# EasyEDA Pro project IMU-V1.eprj

# Schematic Schematic1
Create Date: 2023-02-26; Page Name: P1; Project Name: IMU; Schematic Name: Schematic1; Update Date: 2023-02-27; Company: 嘉立创EDA; Page Size: A4; Version: V1.0
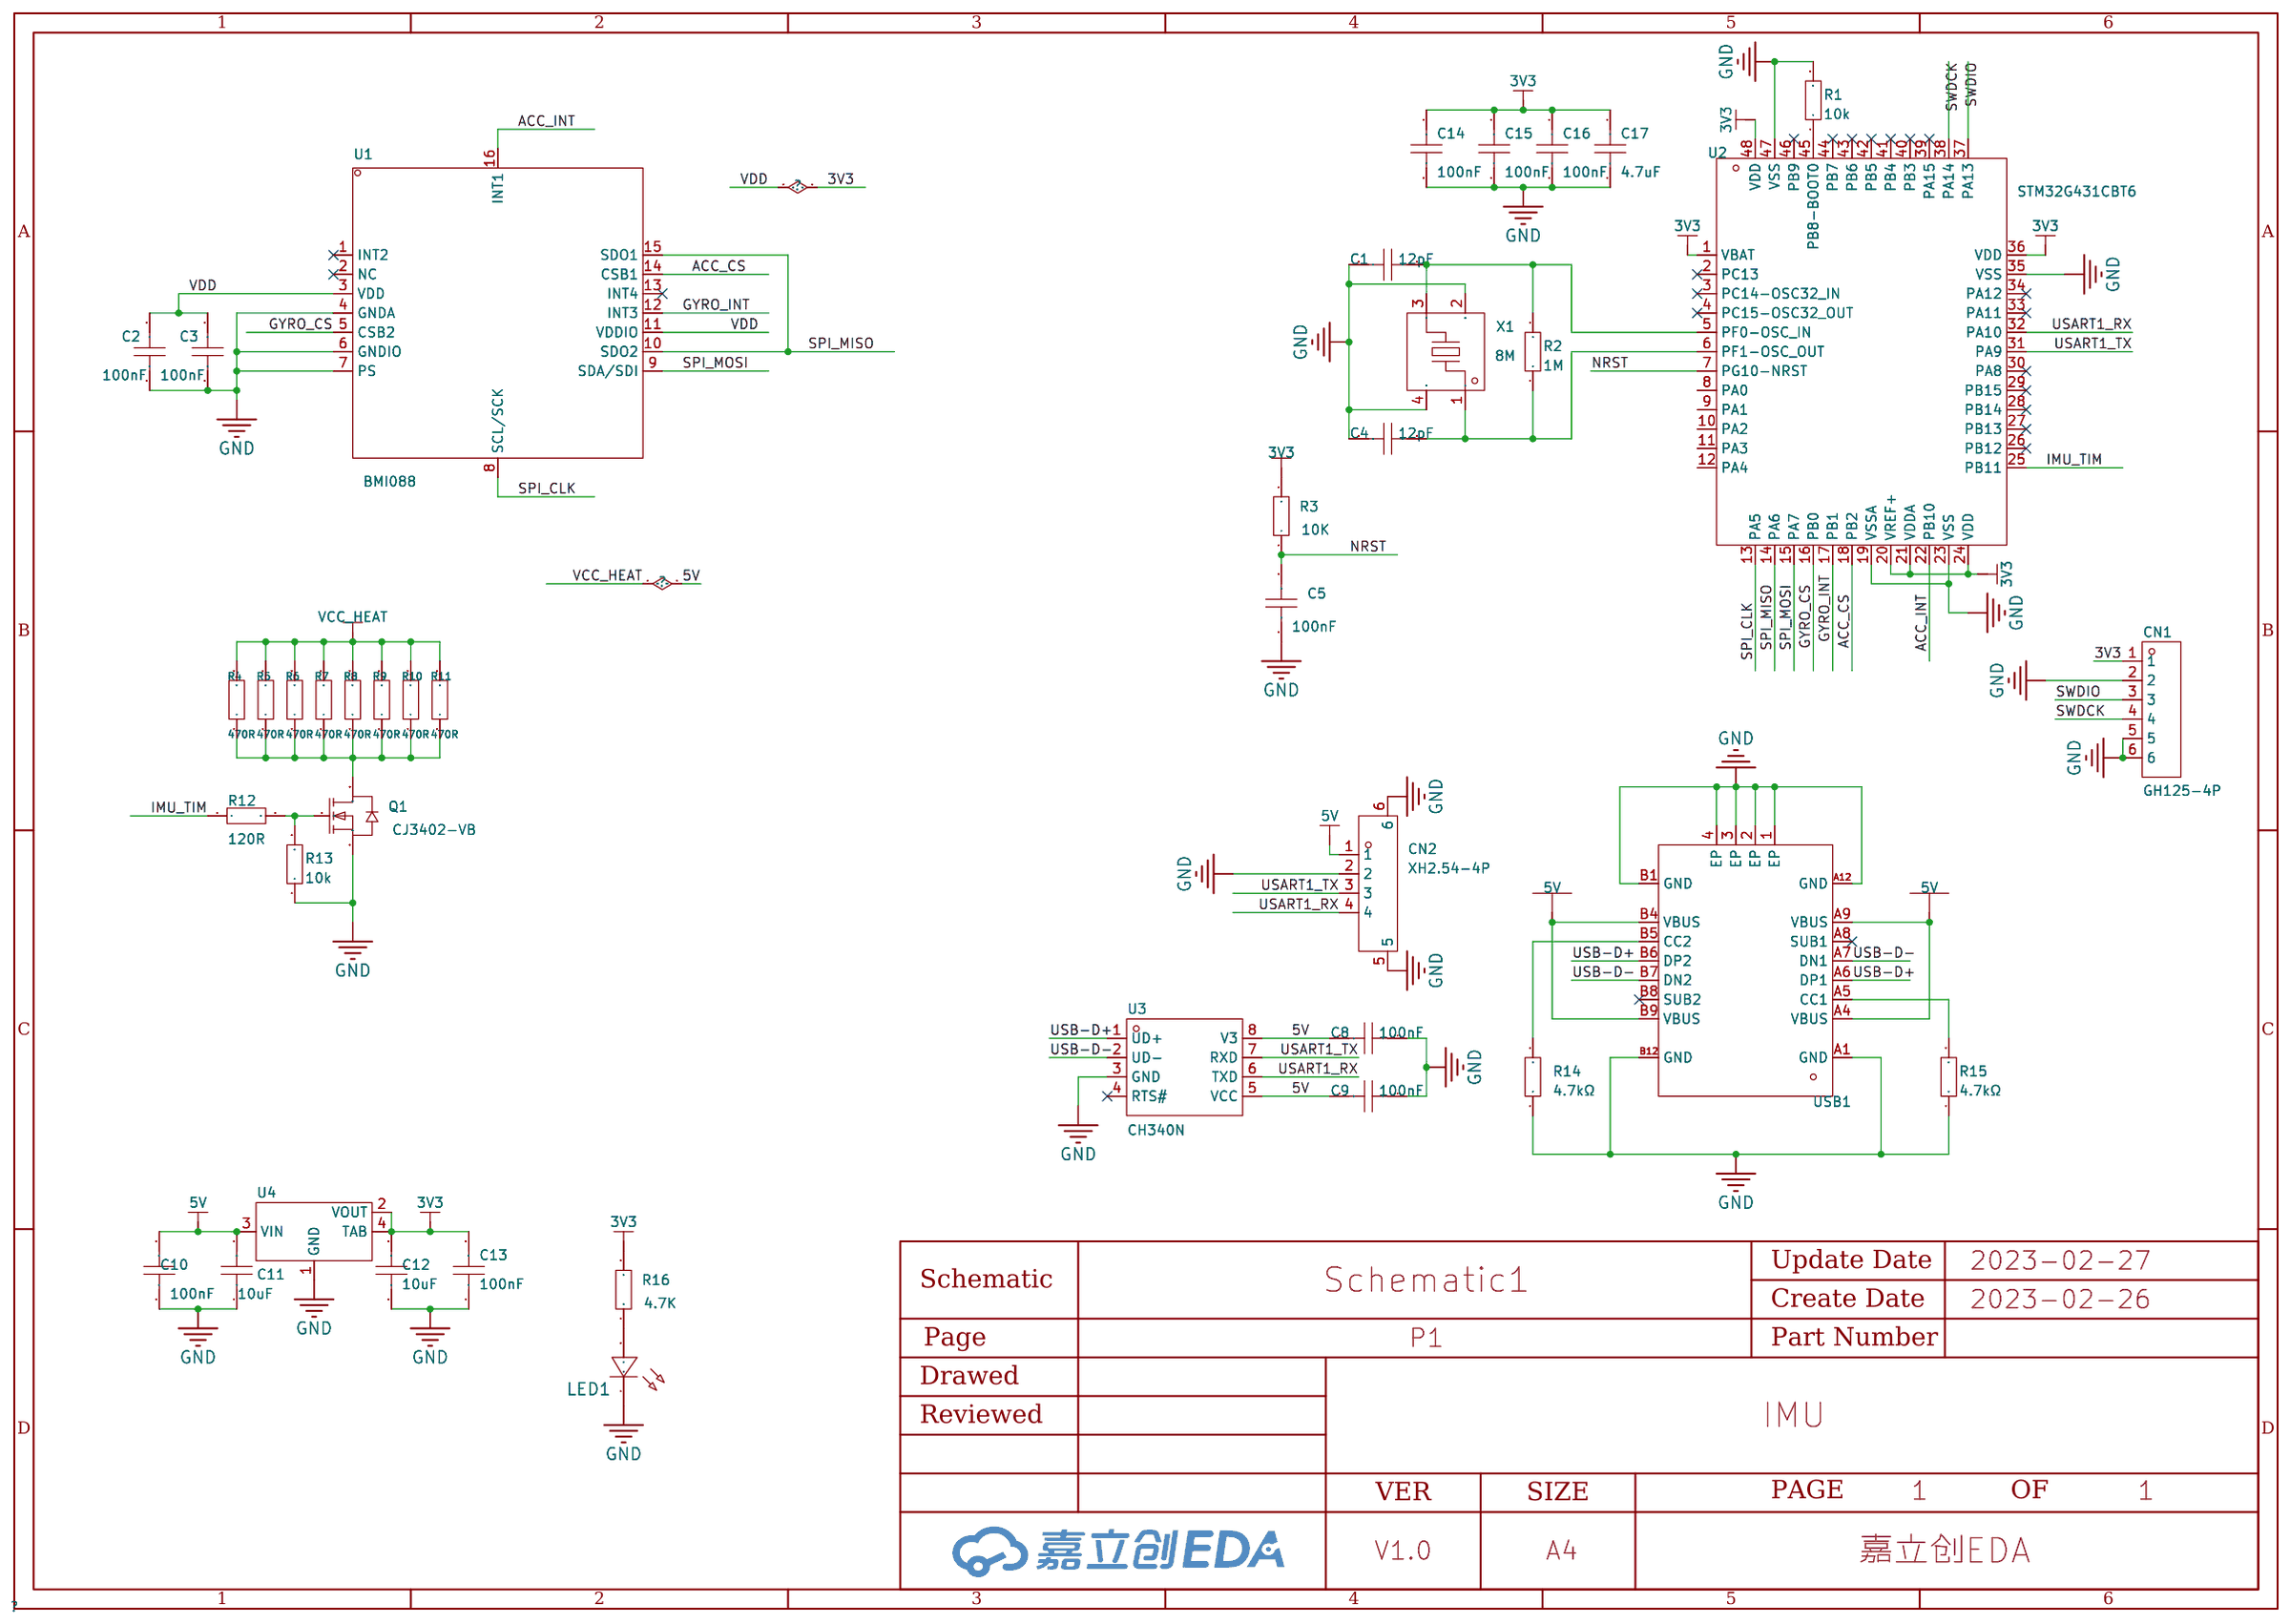
[diagram p0: schematic sheet]

## Parts
C1  12pF  [C0603]
C2  100nF  [C0603]
C3  100nF  [C0603]
C4  12pF  [C0603]
C5  100nF  [C0603_1]
C8  100nF  [C0603_1]
C9  100nF  [C0603_1]
C10  100nF  [C0603_1]
C11  10uF  [C0603_1]
C12  10uF  [C0603_1]
C13  100nF  [C0603_1]
C14  100nF  [C0603]
C15  100nF  [C0603]
C16  100nF  [C0603]
C17  4.7uF  [C0603]
CN1  GH125-4P  [CONN-SMD_4P-P1.27_GH125-S04DCA-00]
CN2  XH2.54-4P  [CONN-TH_4P-P0.20_XUNPU_WAFER-XH2.54-4PWB]
LED1  -  [LED_0603]
Q1  CJ3402-VB  [SOT-23-3_L2.9-W1.6-P1.90-LS2.8-BR]
R1  10k  [R0402]
R2  1M  [R0402]
R3  10K  [R0603_2]
R4  470R  [R0603]
R5  470R  [R0603]
R6  470R  [R0603]
R7  470R  [R0603]
R8  470R  [R0603]
R9  470R  [R0603]
R10  470R  [R0603]
R11  470R  [R0603]
R12  120R  [R0603]
R13  10k  [R0603]
R14  4.7kΩ  [R0402]
R15  4.7kΩ  [R0402]
R16  4.7K  [R0603]
U1  BMI088  [LGA-16_L4.5-W3.0-P0.50-BL]
U2  STM32G431CBT6  [LQFP-48_L7.0-W7.0-P0.50-LS9.0-BL]
U3  CH340N  [SOP-8_L4.9-W3.9-P1.27-LS6.0-BL]
U4  -  [SOT_224]
USB1  -  [USB-C-SMD_KH-TYPE-C-16P_1]
X1  8M  [CRYSTAL-SMD_4P-L3.2-W2.5-BL_1]

## Library data of the parts
C1-C4 C14-C17 = CAP_0603: Supplier Footprint: 0603; Check: true
C5 C8-C13 = CAP_604: Supplier Footprint: 0603; Check: true
CN1 = GH125-S04DCA-00: 参考系列:-;间距:1.25mm;插针结构:1x4P;排数:1;每排PIN数:4;行距:-;公母:公型插针;安装方式:卧贴;额定电流:1A;工作温度范围:-25℃~+85℃;; LCSC Part Name: 1.25mm 1x4P 卧贴; Supplier Part: C2886767; Manufacturer: JS(钜硕电子); Supplier Footprint: SMD,P=1.25mm; JLCPCB Part Class: Extended Part; Datasheet: https://atta.szlcsc.com/upload/public/pdf/source/20210818/CD11791E5ED3EDF45A7009E9C8A2BD4C.pdf; Supplier: LCSC; Pitch: 1.25mm; Pins Structure: 1x4P; Number of Rows: 1; Number of PINs Per Row: 4; Gender: 公型插针; Mounting Style: 卧贴; Current Rating (Max): 1A; Operating Temperature Range: -25℃~+85℃; Check: true
CN2 = WAFER-XH2.54-4PWB: LCSC Part Name: XH2.54mm 4P 卧贴; Supplier Part: C3029478; Manufacturer: XUNPU(讯普); Supplier Footprint: SMD,P=2.5mm; JLCPCB Part Class: Extended Part; Datasheet: https://atta.szlcsc.com/upload/public/pdf/source/20220527/7ACD2214A426F03D9ACD52F5A71E518C.pdf; Supplier: LCSC; Check: true
LED1 = LED_0603-R: Supplier Footprint: 0603; Check: true
Q1 = CJ3402-VB: 类型:N沟道;漏源电压(Vdss):30V;连续漏极电流(Id):6.5A;功率(Pd):-;导通电阻(RDS(on)@Vgs,Id):30mΩ@10V,6.5A;阈值电压(Vgs(th)@Id):-;栅极电荷(Qg@Vgs):-;输入电容(Ciss@Vds):-;反向传输电容(Crss@Vds):-;; LCSC Part Name: N沟道 30V 6.5A; Supplier Part: C709940; Manufacturer: VBsemi(微碧); Supplier Footprint: SOT-23; JLCPCB Part Class: Extended Part; Datasheet: https://atta.szlcsc.com/upload/public/pdf/source/20200723/C709940_FC7E0D7FD36813A0D48B4CA5756C6C42.pdf; Supplier: LCSC; Type: N沟道; Drain Source Voltage (Vdss): 30V; Continuous Drain Current (Id): 6.5A; Drain Source On Resistance (RDS(on)@Vgs,Id): 30mΩ@10V,6.5A; Check: true
R1 R2 R14 R15 = RMC04025.1K5%N: 阻值:5.1kΩ;精度:±5%;功率:1/16W;; LCSC Part Name: 5.1kΩ ±5% 1/16W; Supplier Part: C325524; Manufacturer: Tyohm(幸亚电阻); Supplier Footprint: 0402; JLCPCB Part Class: Extended Part; Datasheet: https://atta.szlcsc.com/upload/public/pdf/source/20190115/C325524_522AE7765A4DE6F7DC0B90EDB62F83C2.pdf; Supplier: LCSC; Tolerance: ±5%; Power(Watts): 1/16W; Check: true
R3 = Res_605: Supplier Footprint: 0603; Check: true
R4-R13 R16 = Res_0603: Supplier Footprint: 0603; Check: true
U1 = BMI088: Supplier Part: C194919; Manufacturer: Bosch(博世); Supplier Footprint: LGA-16; JLCPCB Part Class: Extended Part; Datasheet: https://atta.szlcsc.com/upload/public/pdf/source/20180628/C194919_66CCF125FF968C218A4D358C68AC68D6.pdf; Supplier: LCSC; Check: true
U2 = STM32G431CBT6: CPU内核:ARM Cortex-M4;CPU最大主频:170MHz;工作电压范围:1.71V~3.6V;程序存储容量:128KB;RAM总容量:32KB;EEPROM/数据 FLASH容量:128KB;GPIO端口数量:38;ADC(位数):12bit;DAC(位数):12bit;(E)PWM(位数):-;外设/功能:DMA；PWM；看门狗;内部振荡器:有;工作温度范围:-40℃~+85℃;; LCSC Part Name: ARM Cortex-M4 170MHz; Supplier Part: C529355; Manufacturer: ST(意法半导体); Supplier Footprint: LQFP-48(7x7); JLCPCB Part Class: Extended Part; Datasheet: https://atta.szlcsc.com/upload/public/pdf/source/20200511/C529354_7C66CF00837B904D0C15DCE45B69418C.pdf; Supplier: LCSC; CPU Core: ARM Cortex-M4; CPU Maximum Speed: 170MHz; Operating Voltage Range: 1.71V~3.6V; Program Storage Size: 128KB; Program Memory Type: FLASH; RAM Size: 32KB; EEPROM: 128KB; GPIO Ports Number: 38; ADC (Bit): 12bit; DAC (Bit): 12bit; Peripheral/Function: DMA；PWM；看门狗; Internal Oscillator: 有; Operating Temperature Range: -40℃~+85℃; Check: true
U3 = CH340N: Supplier Part: C2977777; Manufacturer: WCH(南京沁恒); Supplier Footprint: SOP-8; JLCPCB Part Class: Extended Part; Datasheet: https://atta.szlcsc.com/upload/public/pdf/source/20220223/82A45E4FF89B3EDCAD50B354450A7EF4.pdf; Supplier: LCSC; Check: true
U4 = AMS1117_1: Supplier Footprint: SOT_223; Check: true
USB1 = kh-type-c-16p_2: Type-C母座 16PIN 立式四角贴板无压片; LCSC Part Name: Type-C母座; Supplier Part: C709357; Manufacturer: kinghelm(金航标); Manufacturer Part: KH-TYPE-C-16P; LCSC Stock: 5637; LCSC On Sale: 1; Price: 0.484; JLCPCB Part Class: Extended Part; JLCPCB Stock: 2220; JLCPCB On Sale: 1; Datasheet: https://atta.szlcsc.com/upload/public/pdf/source/20200911/C709357_AA8DCEB38BB20E3035A7ED7AE7667837.pdf; Supplier: LCSC; Check: true
X1 = 3225-12-16-10-10/A_1: 工作温度-40℃~+95℃; LCSC Part Name: 3225-12-16-10-10/A; Supplier Part: C2981641; Manufacturer: LIMING(利明); Supplier Footprint: SMD3225-4P; JLCPCB Part Class: Extended Part; Datasheet: https://atta.szlcsc.com/upload/public/pdf/source/20220322/0ABBC579650689231413FB26C3617F3F.pdf; Supplier: LCSC; Check: true

## Nets
3V3: C2.2 C3.2 C12.2 C13.2 C14.1 C15.1 C16.1 C17.1 CN1.1 R3.2 R16.2 U1.3(VDD) U1.11(VDDIO) U2.1(VBAT) U2.20(VREF+) U2.21(VDDA) U2.24(VDD) U2.36(VDD) U2.48(VDD) U4.2(VOUT) U4.4(TAB)
5V: C8.2 C9.2 C10.2 C11.2 CN2.1 R4.2 R5.2 R6.2 R7.2 R8.2 R9.2 R10.2 R11.2 U3.5(VCC) U3.8(V3) U4.3(VIN) USB1.A4(VBUS) USB1.A9(VBUS) USB1.B4(VBUS) USB1.B9(VBUS)
GND: C1.2 C2.1 C3.1 C4.2 C5.1 C8.1 C9.1 C10.1 C11.1 C12.1 C13.1 C14.2 C15.2 C16.2 C17.2 CN1.2 CN1.5 CN1.6 CN2.2 CN2.5 CN2.6 LED1.1(C) Q1.2(S) R1.2 R13.1 R14.1 R15.1 U1.4(GNDA) U1.6(GNDIO) U1.7(PS) U2.19(VSSA) U2.23(VSS) U2.35(VSS) U2.47(VSS) U3.3(GND) U4.1(GND) USB1.1(EP) USB1.2(EP) USB1.3(EP) USB1.4(EP) USB1.A1(GND) USB1.A12(GND) USB1.B1(GND) USB1.B12(GND) X1.2(GND) X1.4(GND)
ACC_CS: U1.14(CSB1) U2.18(PB2)
ACC_INT: U1.16(INT1) U2.22(PB10)
GYRO_CS: U1.5(CSB2) U2.16(PB0)
GYRO_INT: U1.12(INT3) U2.17(PB1)
IMU_TIM: R12.1 U2.25(PB11)
NRST: C5.2 R3.1 U2.7(PG10-NRST)
SPI_CLK: U1.8(SCL/SCK) U2.13(PA5)
SPI_MISO: U1.10(SDO2) U1.15(SDO1) U2.14(PA6)
SPI_MOSI: U1.9(SDA/SDI) U2.15(PA7)
SWDCK: CN1.4 U2.38(PA14)
SWDIO: CN1.3 U2.37(PA13)
USART1_RX: CN2.4 U2.32(PA10) U3.6(TXD)
USART1_TX: CN2.3 U2.31(PA9) U3.7(RXD)
USB-D+: U3.1(UD+) USB1.A6(DP1) USB1.B6(DP2)
USB-D-: U3.2(UD-) USB1.A7(DN1) USB1.B7(DN2)
$C1_1: C1.1 R2.2 U2.5(PF0-OSC_IN) X1.3
$C4_1: C4.1 R2.1 U2.6(PF1-OSC_OUT) X1.1
$LED1_2: LED1.2(A) R16.1
$Q1_1: Q1.1(G) R12.2 R13.2
$Q1_3: Q1.3(D) R4.1 R5.1 R6.1 R7.1 R8.1 R9.1 R10.1 R11.1
$R1_1: R1.1 U2.45(PB8-BOOT0)
$R14_2: R14.2 USB1.B5(CC2)
$R15_2: R15.2 USB1.A5(CC1)

Not connected (* = marked no-connect by the designer): U1 1(INT2)* 2(NC)* 13(INT4)*; U2 2(PC13)* 3(PC14-OSC32_IN)* 4(PC15-OSC32_OUT)* 8(PA0) 9(PA1) 10(PA2) 11(PA3) 12(PA4) 26(PB12)* 27(PB13)* 28(PB14)* 29(PB15)* 30(PA8)* 33(PA11)* 34(PA12)* 39(PA15)* 40(PB3)* 41(PB4)* 42(PB5)* 43(PB6)* 44(PB7)* 46(PB9)*; U3 4(RTS#)*; USB1 A8(SUB1)* B8(SUB2)*

# Board PCB1
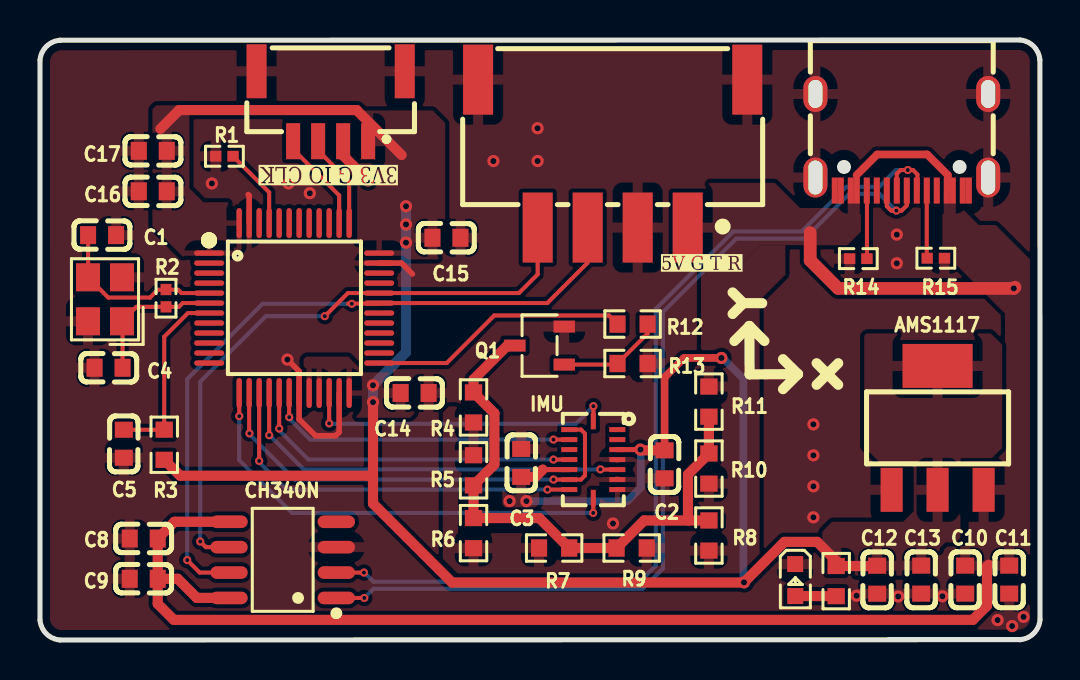
[diagram p1: board, top side]
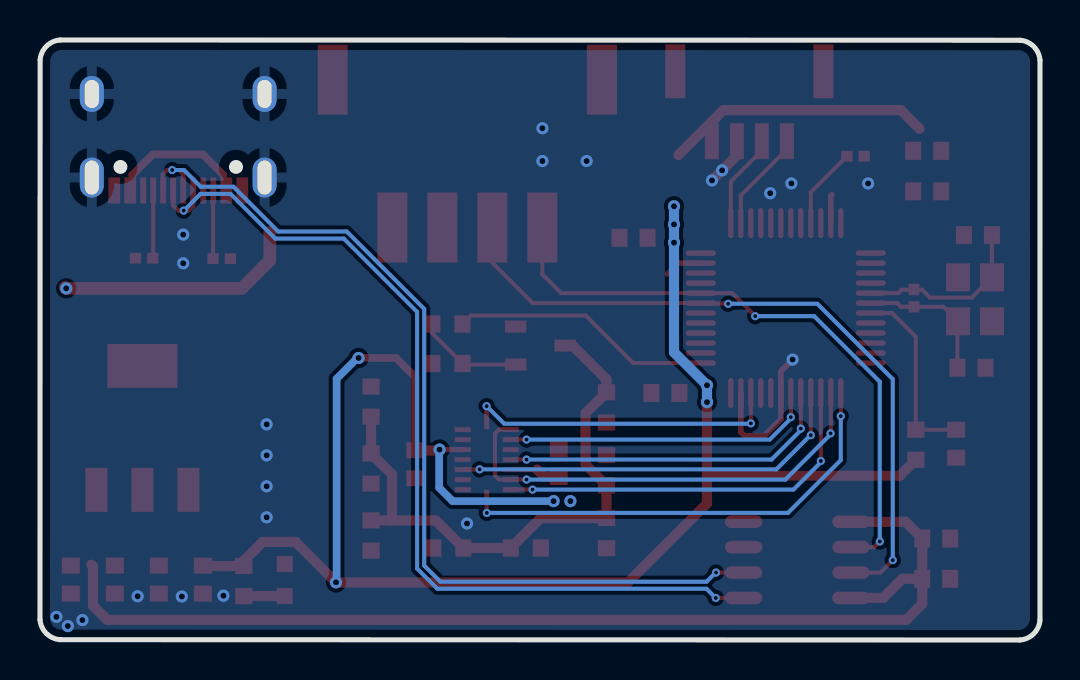
[diagram p2: board, bottom side, seen from below]

Outline 50 x 30.01 mm; copper layers: Top Layer, Bottom Layer. Coordinates in mm from the lower left corner of the outline.
Outline path: 0,29 arc(0.31,29.68) 1,30 49,30.01 arc(49.68,29.7) 50,29.01 50,1.02 arc(49.69,0.33) 49,0.02 1,0 arc(0.32,0.31) 0,1 0,29
Stack: Top Layer 0.035mm / Dielectric1 1.51mm FR4 er 4.5 / Bottom Layer 0.035mm

## Design rules (mm)
net 3V3: PWR
net GND: PWR
net 5V: PWR
net USB-D+: DP1
net USB-D-: DP1
spacing safeClearance (default): track to track 0.152, other pairs 0.152 to 0.381
track width trackWidth (default): min 0.127, default 0.203, max 2.54
differential pair differentialPair (default): width min 0.127, default 0.254, max 2.54; gap min 0.152, default 0.152
via viaSize (default): diameter min 0.406, default 0.61, max 10; hole min 0.203, default 0.305, max 5.999

## Placement (name value [footprint] x y rotation side)
3V3GNDSIOSCLK  GH125-4P  [CONN-SMD_4P-P1.27_GH125-S04DCA-00]  14.53 26.7 180 top
5V G T R  XH2.54-4P  [CONN-TH_4P-P0.20_XUNPU_WAFER-XH2.54-4PWB]  28.63 24.33 180 top
AMS1117  -  [SOT_224]  44.88 10.64 0 top
C1  12pF  [C0603]  3.1 20.25 0 top
C2  100nF  [C0603]  31.23 8.79 90 top
C3  100nF  [C0603]  24.06 8.86 270 top
C4  12pF  [C0603]  3.43 13.62 180 top
C5  100nF  [C0603_1]  4.19 9.82 90 top
C8  100nF  [C0603_1]  5.19 5.08 0 top
C9  100nF  [C0603_1]  5.19 3.06 0 top
C10  100nF  [C0603_1]  46.26 3.02 90 top
C11  10uF  [C0603_1]  48.46 3.02 90 top
C12  10uF  [C0603_1]  41.86 3.02 90 top
C13  100nF  [C0603_1]  44.06 3.02 90 top
C14  100nF  [C0603]  18.73 12.36 0 top
C15  100nF  [C0603]  20.32 20.12 0 top
C16  100nF  [C0603]  5.64 22.44 180 top
C17  4.7uF  [C0603]  5.64 24.47 180 top
CH340N  CH340N  [SOP-8_L4.9-W3.9-P1.27-LS6.0-BL]  12.13 4.01 90 top
IMU  BMI088  [LGA-16_L4.5-W3.0-P0.50-BL]  27.67 9.03 180 top
LED1  -  [LED_0603]  37.77 2.95 270 top
Q1  CJ3402-VB  [SOT-23-3_L2.9-W1.6-P1.90-LS2.8-BR]  24.98 14.73 0 top
R1  10k  [R0402]  9.22 24.2 180 top
R2  1M  [R0402]  6.3 17.1 90 top
R3  10K  [R0603_2]  6.21 9.77 270 top
R4  470R  [R0603]  21.68 11.63 270 top
R5  470R  [R0603]  21.68 8.49 90 top
R6  470R  [R0603]  21.68 5.35 270 top
R7  470R  [R0603]  25.71 4.6 180 top
R8  470R  [R0603]  33.45 5.23 270 top
R9  470R  [R0603]  29.58 4.6 0 top
R10  470R  [R0603]  33.45 8.58 270 top
R11  470R  [R0603]  33.45 11.92 90 top
R12  120R  [R0603]  29.63 15.8 0 top
R13  10k  [R0603]  29.63 13.83 180 top
R14  4.7kΩ  [R0402]  40.92 19.08 0 top
R15  4.7kΩ  [R0402]  44.79 19.1 180 top
R16  4.7K  [R0603]  39.81 2.95 90 top
U2  STM32G431CBT6  [LQFP-48_L7.0-W7.0-P0.50-LS9.0-BL]  12.71 16.6 270 top
USB1  -  [USB-C-SMD_KH-TYPE-C-16P_1]  43.09 24.9 180 top
X1  8M  [CRYSTAL-SMD_4P-L3.2-W2.5-BL_1]  3.25 17.04 90 top

## Footprints (pads in the part's own frame, mm; a bottom-side part is the same pattern mirrored in y, then rotated)
C0603
  rect 0.8x0.9 smd: 1(-0.7,0) 2(0.7,0)
C0603_1
  rect 0.8x0.9 smd: 1(-0.7,0) 2(0.7,0)
CONN-SMD_4P-P1.27_GH125-S04DCA-00
  rect 0.7x1.8 smd: 1(-1.875,1.75) 2(-0.625,1.75) 3(0.625,1.75) 4(1.875,1.75)
  rect 1x2.7 smd: 5(3.705,-1.75) 6(-3.705,-1.75)
CONN-TH_4P-P0.20_XUNPU_WAFER-XH2.54-4PWB
  rect 1.5x3.5 smd: 1(-3.75,3.7) 2(-1.25,3.7) 3(1.25,3.7) 4(3.75,3.7) 5(-6.73,-3.7) 6(6.73,-3.7)
CRYSTAL-SMD_4P-L3.2-W2.5-BL_1
  rect 1.4x1.2 smd: 1(-1.1,-0.85) 2(1.1,-0.85) 3(1.1,0.85) 4(-1.1,0.85)
LED_0603
  rect 0.8x0.8 smd: 1(-0.851,-0.01) 2(0.75,-0.005)
LGA-16_L4.5-W3.0-P0.50-BL
  rect 0.8x0.25 smd: 1(-1.2,-1.498) 2(-1.2,-0.998) 3(-1.2,-0.498) 4(-1.2,0.002) 5(-1.2,0.502) 6(-1.2,1.002) 7(-1.2,1.502) 9(1.2,1.502) 10(1.2,1.002) 11(1.2,0.502) 12(1.2,0.002) 13(1.2,-0.498) 14(1.2,-0.998) 15(1.2,-1.498)
  rect 0.25x0.8 smd: 8(0,1.915) 16(0,-1.915)
LQFP-48_L7.0-W7.0-P0.50-LS9.0-BL
  oval 0.27x1.5 smd: 1(-2.75,-4.25) 2(-2.25,-4.25) 3(-1.75,-4.25) 4(-1.25,-4.25) 5(-0.75,-4.25) 6(-0.25,-4.25) 7(0.25,-4.25) 8(0.75,-4.25) 9(1.25,-4.25) 10(1.75,-4.25) 11(2.25,-4.25) 12(2.75,-4.25) 25(2.75,4.25) 26(2.25,4.25) 27(1.75,4.25) 28(1.25,4.25) 29(0.75,4.25) 30(0.25,4.25) 31(-0.25,4.25) 32(-0.75,4.25) 33(-1.25,4.25) 34(-1.75,4.25) 35(-2.25,4.25) 36(-2.75,4.25)
  oval 1.5x0.27 smd: 13(4.25,-2.75) 14(4.25,-2.25) 15(4.25,-1.75) 16(4.25,-1.25) 17(4.25,-0.75) 18(4.25,-0.25) 19(4.25,0.25) 20(4.25,0.75) 21(4.25,1.25) 22(4.25,1.75) 23(4.25,2.25) 24(4.25,2.75) 37(-4.25,2.75) 38(-4.25,2.25) 39(-4.25,1.75) 40(-4.25,1.25) 41(-4.25,0.75) 42(-4.25,0.25) 43(-4.25,-0.25) 44(-4.25,-0.75) 45(-4.25,-1.25) 46(-4.25,-1.75) 47(-4.25,-2.25) 48(-4.25,-2.75)
R0402
  rect 0.566x0.54 smd: 1(-0.433,0) 2(0.433,0)
R0603
  rect 0.806x0.864 smd: 1(-0.753,0) 2(0.753,0)
R0603_2
  rect 0.806x0.864 smd: 1(-0.753,0) 2(0.753,0)
SOP-8_L4.9-W3.9-P1.27-LS6.0-BL
  oval 0.63x1.865 smd: 1(-1.905,-2.683) 2(-0.635,-2.683) 3(0.635,-2.683) 4(1.905,-2.683) 5(1.905,2.683) 6(0.635,2.683) 7(-0.635,2.683) 8(-1.905,2.683)
SOT-23-3_L2.9-W1.6-P1.90-LS2.8-BR
  rect 1.07x0.6 smd: 1(1.235,-0.95) 2(1.235,0.95) 3(-1.235,0)
SOT_224
  rect 1.1x2.2 smd: 1(-2.299,-3.126) 2(0,-3.126) 3(2.301,-3.126)
  rect 3.5x2.2 smd: 4(0,3.072)
USB-C-SMD_KH-TYPE-C-16P_1
  oval 1.2x2 hole 0.7x1.7: 1(-4.32,1.765) 2(4.32,1.765)
  oval 1.2x1.8 hole 0.7x1.4: 3(-4.32,-2.415) 4(4.32,-2.415)
  rect 0.3x1.3 smd: A1(-3.35,2.415) A4(-2.55,2.415) A5(-1.25,2.415) A6(-0.25,2.415) A7(0.25,2.415) A8(1.25,2.415) A9(2.55,2.415) A12(3.35,2.415) B1(3.05,2.415) B4(2.25,2.415) B5(1.75,2.415) B6(0.75,2.415) B7(-0.75,2.415) B8(-1.75,2.415) B9(-2.25,2.415) B12(-3.05,2.415)

## Nets
3V3: 3V3GNDSIOSCLK.1 AMS1117.2 AMS1117.4 C2.2 C3.2 C12.2 C13.2 C14.1 C15.1 C16.1 C17.1 IMU.3 IMU.11 R3.2 R16.2 U2.1 U2.20 U2.21 U2.24 U2.36 U2.48
5V: 5V G T R.1 AMS1117.3 C8.2 C9.2 C10.2 C11.2 CH340N.5 CH340N.8 R4.2 R5.2 R6.2 R7.2 R8.2 R9.2 R10.2 R11.2 USB1.A4 USB1.A9 USB1.B4 USB1.B9
GND: 3V3GNDSIOSCLK.2 3V3GNDSIOSCLK.5 3V3GNDSIOSCLK.6 5V G T R.2 5V G T R.5 5V G T R.6 AMS1117.1 C1.2 C2.1 C3.1 C4.2 C5.1 C8.1 C9.1 C10.1 C11.1 C12.1 C13.1 C14.2 C15.2 C16.2 C17.2 CH340N.3 IMU.4 IMU.6 IMU.7 LED1.1 Q1.2 R1.2 R13.1 R14.1 R15.1 U2.19 U2.23 U2.35 U2.47 USB1.1 USB1.2 USB1.3 USB1.4 USB1.A1 USB1.A12 USB1.B1 USB1.B12 X1.2 X1.4
$C1_1: C1.1 R2.2 U2.5 X1.3
$C4_1: C4.1 R2.1 U2.6 X1.1
$LED1_2: LED1.2 R16.1
$Q1_1: Q1.1 R12.2 R13.2
$Q1_3: Q1.3 R4.1 R5.1 R6.1 R7.1 R8.1 R9.1 R10.1 R11.1
$R1_1: R1.1 U2.45
$R14_2: R14.2 USB1.B5
$R15_2: R15.2 USB1.A5
ACC_CS: IMU.14 U2.18
ACC_INT: IMU.16 U2.22
GYRO_CS: IMU.5 U2.16
GYRO_INT: IMU.12 U2.17
IMU_TIM: R12.1 U2.25
NRST: C5.2 R3.1 U2.7
SPI_CLK: IMU.8 U2.13
SPI_MISO: IMU.10 IMU.15 U2.14
SPI_MOSI: IMU.9 U2.15
SWDCK: 3V3GNDSIOSCLK.4 U2.38
SWDIO: 3V3GNDSIOSCLK.3 U2.37
USART1_RX: 5V G T R.4 CH340N.6 U2.32
USART1_TX: 5V G T R.3 CH340N.7 U2.31
USB-D+: CH340N.1 USB1.A6 USB1.B6
USB-D-: CH340N.2 USB1.A7 USB1.B7

Pads without a net: CH340N 4; IMU 1 2 13; U2 2 3 4 8 9 10 11 12 26 27 28 29 30 33 34 39 40 41 42 43 44 46; USB1 A8 B8

## Via types
v1: diameter 0.406, hole 0.203, Top Layer to Bottom Layer, 22 vias
v2: diameter 0.61, hole 0.305, Top Layer to Bottom Layer, 33 vias

## Routing (per net, layer and track width the routed paths; a pad name or vN(x,y) marks a point on that pad's centre or on a via; arc(x,y) is an arc through that point)
3V3: length 99.5
  Top Layer w0.254: IMU.11 25.14,8.52 ; IMU.3 v2(30.02,9.52)
  Top Layer w0.381: C2.2 31.23,13.14 32.2,14.11 v2(34.07,14.11) ; v2(30.02,9.52) 30.06,9.49
  Top Layer w0.508: 6.02,25.57 6.96,26.51 15.83,26.51 18.08,24.26 ; C12.2 41.84,3.7 R16.2 39.81,3.96 38.86,4.91 37.22,4.91 v2(35.2,2.88) ; 16.65,8.22 v2(16.65,11.9) ; 16.65,8.22 16.65,6.83 20.6,2.88 35.19,2.88 ; 16.65,8.22 7.01,8.22 R3.2 ; C2.2 30.06,9.49 ; 25.14,8.52 24.77,8.16 C3.2
  Bottom Layer w0.381: v2(24.32,6.95) 29.37,6.95 30.04,7.62 30.04,9.51 v2(30.02,9.52) ; v2(34.07,14.11) 34.13,14.11 35.17,13.07 35.17,2.91 v2(35.2,2.88)
  Bottom Layer w0.508: v2(16.65,11.9) v2(16.65,12.74) 18.3,14.39 v2(18.3,19.88) v2(18.3,20.79) v2(18.3,21.7)
  vias: v2(23.48,6.95)
5V: length 73.7
  Top Layer w0.381: 40.83,23.26 41.86,24.29 44.36,24.29 45.39,23.26 45.39,22.53
  Top Layer w0.508: 47.43,3.77 47.35,3.69 47.35,1.72 46.64,1.01 6.69,1.01 5.89,1.81 C9.2 ; C9.2 C8.2 6.72,5.91 CH340N.5 ; C9.2 6.89,3.06 7.84,2.11 9.45,2.11 CH340N.8
  Top Layer w0.635: 38.51,20.38 38.51,18.99 39.91,17.59 v2(48.69,17.59) 48.75,17.65
GND: length 13.4
  Top Layer w0.28: 10.41,22.28 10.46,22.23 U2.47 ; v2(12.37,14.03) 12.96,13.44 U2.19 ; 12.96,12.35 12.96,11.04 13.78,10.22 14.78,10.22 14.96,10.4 U2.23 ; 18.62,18.31 18.07,18.85 U2.35
  Top Layer w0.508: 3V3GNDSIOSCLK.2 15.16,24.23 v2(15.9,23.49) v2(16.4,22.99)
  vias: v2(8.59,22.84) v2(12.43,22.84) v2(13.49,22.35) v2(22.67,23.96) v2(24.88,25.6) v2(24.88,23.96) v2(28.65,5.83) v2(38.67,10.79) v2(38.67,9.24) v2(38.67,7.69) v2(38.67,6.14) v2(40.83,2.22) v2(42.84,20.28) v2(42.84,18.84) v2(42.91,2.18) v2(45.12,2.19) v2(47.88,1) v2(48.61,0.7) v2(49.18,1.16)
$C1_1: length 8.8
  Top Layer w0.203: 6.31,17.52 5.89,17.52 5.5,17.13 3.41,17.13 X1.3 2.4,18.15 C1.1 ; 6.31,17.52 6.91,17.52 7.07,17.35 U2.5 ; 6.31,17.52 R2.2
$C4_1: length 7.1
  Top Layer w0.203: 4.15,15.89 4.13,15.91 ; 4.13,15.91 4.1,15.94 4.82,16.66 6.95,16.66 7.14,16.85 U2.6 ; 4.13,15.91 C4.1
$LED1_2: length 2
  Top Layer w0.508: 37.77,2.2 39.81,2.2 R16.1
$Q1_1: length 5.3
  Top Layer w0.203: 26.21,13.78 28.82,13.78 R13.2 30.38,15.34 R12.2
$Q1_3: length 29.2
  Top Layer w0.508: R11.1 R10.1 32.4,8.28 32.4,6.01 32.43,5.98 ; 32.43,5.98 R8.1 ; 32.43,5.98 30.21,5.98 R9.1 R7.1 24.96,6.1 R6.1 R5.1 22.72,8.78 22.72,11.34 R4.1 21.68,13.03 23.37,14.73 Q1.3
$R1_1: length 4.1
  Top Layer w0.203: R1.1 11.46,22.39 U2.45
$R14_2: length 3.4
  Top Layer w0.203: USB1.B5 41.35,22.47 R14.2
$R15_2: length 3.4
  Top Layer w0.203: USB1.A5 44.38,22.44 ; 44.34,22.44 44.34,19.06
ACC_CS: length 15.7
  Top Layer w0.203: IMU.14 v1(25.67,10.02) ; v1(12.46,11.15) 12.46,11.15 U2.18
  Bottom Layer w0.203: v1(25.67,10.02) 13.51,10.02 12.46,11.08 v1(12.46,11.15)
ACC_INT: length 15.8
  Top Layer w0.203: U2.22 v1(14.46,10.84) 14.45,10.83 ; v1(27.67,11.7) 27.67,10.95 IMU.16
  Bottom Layer w0.203: 14.51,10.84 14.53,10.82 26.79,10.82 v1(27.67,11.7)
GYRO_CS: length 20.2
  Top Layer w0.203: IMU.5 28.03,8.52 v1(28.02,8.54) ; v1(11.46,10.25) U2.16
  Bottom Layer w0.203: v1(28.02,8.54) 13.18,8.54 11.47,10.25 v1(11.46,10.25)
GYRO_INT: length 17
  Top Layer w0.203: U2.17 11.96,12.35 v1(11.96,10.58) ; IMU.12 v1(25.67,9.02)
  Bottom Layer w0.203: v1(11.96,10.58) 11.96,10.49 13.42,9.03 25.67,9.03 v1(25.67,9.02)
IMU_TIM: length 13.1
  Top Layer w0.203: R12.1 28.45,16.23 22.71,16.23 20.34,13.85 U2.25
NRST: length 9.4
  Top Layer w0.203: 6.21,10.52 C5.2 ; U2.7 7.4,16.35 6.21,15.17 R3.1
  Top Layer w0.508: R3.1 6.21,10.52
SPI_CLK: length 22.9
  Top Layer w0.203: v1(27.66,6.36) 27.67,6.36 IMU.8 ; U2.13 9.96,12.35 v1(9.96,11.2)
  Bottom Layer w0.203: v1(27.66,6.36) 12.6,6.36 9.96,9 v1(9.96,11.2)
SPI_MISO: length 22.8
  Top Layer w0.203: U2.14 10.46,10.35 v1(10.47,10.34) ; v1(25.67,8.02) IMU.10 27.05,8.02 27.25,8.23 27.25,10.32 27.05,10.52 IMU.15
  Bottom Layer w0.203: v1(25.67,8.02) 12.73,8.02 10.47,10.29 v1(10.47,10.34)
SPI_MOSI: length 19.5
  Top Layer w0.203: v1(25.37,7.52) IMU.9 ; v1(10.96,8.96) U2.15
  Bottom Layer w0.203: v1(10.96,8.96) 10.96,8.89 12.32,7.52 v1(25.37,7.52)
SWDCK: length 5.2
  Top Layer w0.203: U2.38 14.96,22.24 12.66,24.54 12.66,25.1
SWDIO: length 4.9
  Top Layer w0.203: U2.37 15.46,22.93 13.91,24.48 13.91,25.1
USART1_RX: length 31.4
  Top Layer w0.203: 24.88,21.02 24.88,18.29 23.95,17.35 U2.32 15.4,17.35 v1(14.24,16.2) ; CH340N.6 8.29,4.64 v1(8.01,4.93)
  Bottom Layer w0.203: v1(14.24,16.2) 11.29,16.2 8.01,12.92 v1(8.01,4.93)
USART1_TX: length 36.2
  Top Layer w0.203: 27.38,21.02 27.37,21.01 27.37,18.86 25.37,16.85 U2.31 16.92,16.82 ; 15.41,16.83 16.92,16.83 ; v1(7.36,4) 7.98,3.37 CH340N.7
  Bottom Layer w0.203: v1(15.59,16.82) 11.13,16.82 7.36,13.05 7.36,3.95
USB-D+: length 47
  Top Layer w0.203: USB1.B6 42.34,21.7 42.56,21.48 v1(42.82,21.48) 43.08,21.48 43.34,21.74 USB1.A6 ; v1(16.21,2.1) CH340N.1
  Bottom Layer w0.203: v1(42.82,21.48) 42.81,21.48 41.97,22.31 40.47,22.31 38.24,20.08 34.81,20.08 31.15,16.41 31.15,3.58 30.13,2.56 16.67,2.56 16.22,2.1 v1(16.21,2.1)
USB-D-: length 47.7
  Top Layer w0.203: USB1.A7 42.84,23.32 43.03,23.51 v1(43.39,23.51) 43.65,23.51 43.87,23.29 43.87,22.51 USB1.B7 ; v1(16.2,3.37) CH340N.2
  Bottom Layer w0.203: v1(43.39,23.51) 42.8,23.51 41.96,22.67 40.33,22.67 38.09,20.43 34.66,20.43 30.79,16.56 30.79,3.72 29.98,2.92 16.67,2.92 16.21,3.37 v1(16.2,3.37)

## Copper pours and planes (outline as drawn; the poured copper is in the pictures)
3V3 on Top Layer: 16.03,26.49 19.64,26.49 20.26,25.87 20.26,19.41 19.89,19.04 16.18,19.04 16.05,19.17 16.05,19.54 15.86,19.73 15.86,26.32
3V3 on Top Layer: 23.21,8.87 24.64,8.87 24.97,8.54 24.97,6.83 24.77,6.64 23.24,6.64 23.11,6.77 23.11,8.77
3V3 on Top Layer: 7.32,26.75 7.47,26.6 7.47,22.6 8.17,21.9 10.09,21.9 10.18,21.81 10.19,21.81 10.19,19.65 9.59,19.05 7.27,19.05 5.62,20.69 5.62,26.56 5.81,26.75
3V3 on Top Layer: 13.31,14.18 15.41,14.18 16.2,13.39 18.39,13.39 18.72,13.06 18.72,11.33 18.51,11.12 13.33,11.12 13.18,11.27 13.18,14.05
3V3 on Top Layer: 41.33,15.34 47.54,15.34 48.11,14.77 48.11,9.61 47.6,9.1 46.08,9.1 46.02,9.04 46.02,5.11 45.8,4.89 45.28,4.89 44.99,4.6 44.99,3.33 44.88,3.22 39.32,3.22 39.12,3.42 39.12,5.42 39.61,5.92 43.16,5.92 43.69,6.45 43.69,8.62 43.46,8.85 42.02,8.85 41.21,9.66 41.21,15.22
5V on Top Layer: 45.15,23.5 45.62,23.5 45.86,23.27 45.86,21.84 46.94,20.76 47.79,20.76 49.51,19.04 49.51,3.35 49.17,3.01 45.4,3.01 45.22,3.2 45.22,4.32 45.6,4.7 46.22,4.7 46.43,4.91 46.43,8.52 46.85,8.94 47.53,8.94 48.25,9.66 48.25,16.33 45.12,19.46 45.12,23.33 45.22,23.43
5V on Top Layer: 31.58,22.87 36.74,22.87 38,21.61 40.09,21.61 40.26,21.78 40.26,23.13 40.39,23.26 40.95,23.26 41.1,23.11 41.1,20.48 40.37,19.75 36.05,19.75 34.71,18.41 31.52,18.41 31.17,18.76 31.17,22.46
5V on Top Layer: 21.86,11.69 22.34,11.21 22.34,8.89 21.79,8.35 21.24,8.35 20.9,8.01 20.9,5.46 21.02,5.35 25.08,5.35 25.83,4.6 25.83,4.22 25.99,4.06 29.32,4.06 29.41,4.16 29.41,4.65 30.2,5.44 34.11,5.44 34.3,5.64 34.3,6.26 33.95,6.61 33.12,6.61 32.89,6.84 32.89,8.23 33.37,8.71 33.77,8.71 34.06,9 34.11,9 34.11,11.66 33.93,11.84 32.89,11.84 32.48,12.25 32.48,13.38 33.05,13.95 33.05,18.63 34.05,19.63 34.05,20.1 37.16,20.1 37.27,19.99 37.27,18.27 35.98,16.98 35.98,3.74 35.48,3.24 20.96,3.24 20.14,4.07 20.14,11.38 20.45,11.69
GND on Top Layer: -2.11,-1.3 50.51,-1.3 50.51,31.79 -2.11,31.79
GND on Bottom Layer: -2.11,-1.3 50.51,-1.3 50.51,31.79 -2.11,31.79

Small or netless copper shapes (teardrops, artwork), in the pictures only: 1 on Top Layer

## Text on the board
Top Silkscreen Layer: 3V3 G IO CLK
